# EAGLE design Counter (EAGLE 8.6.1)
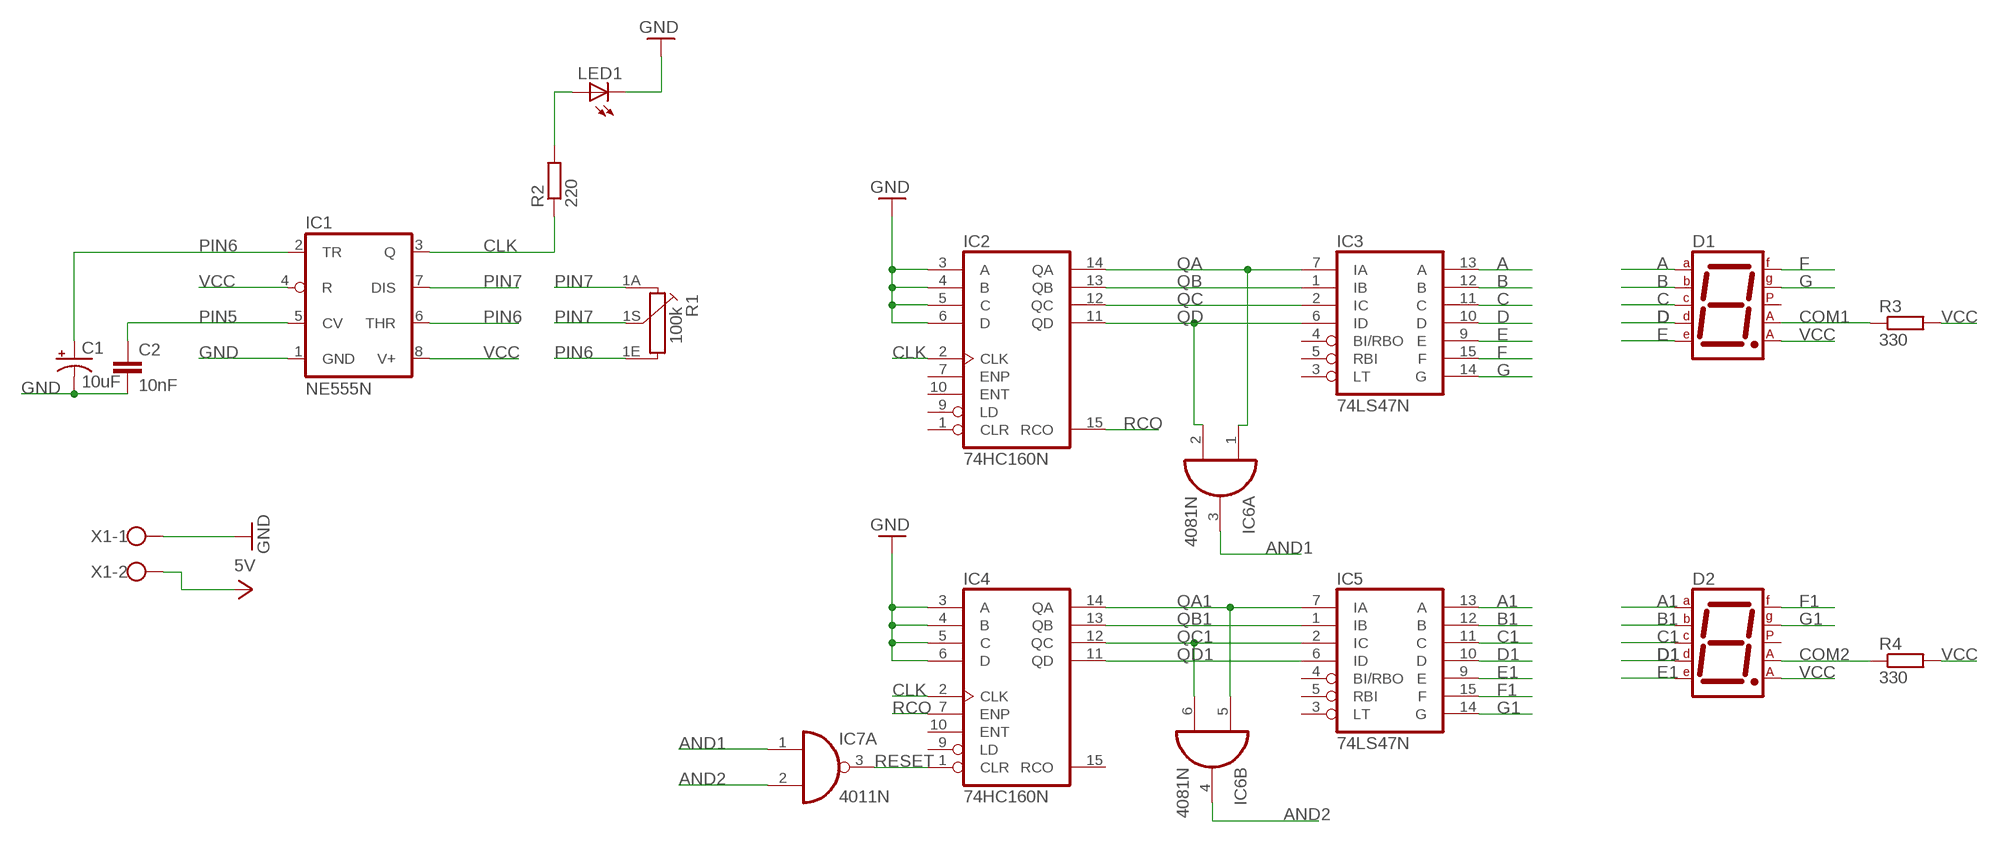
[diagram p0: schematic, sheet 1]

## Parts
C1  10uF  CPOL-USE2.5-7  [E2,5-7]
C2  10nF  C-EU050-025X075  [C050-025X075]
D1  7SEG-CA  [7SEG-13]
D2  7SEG-CA  [7SEG-13]
IC1  NE555N  [DIL08-ROUND]
IC2  74HC160N  [DIL16]
IC3  74LS47N  [DIL16]
IC4  74HC160N  [DIL16]
IC5  74LS47N  [DIL16]
IC6  4081N  [DIL14]
IC7  4011N  [DIL14]
LED1  LED5MM  [LED5MM]
R1  100k  PC16S  [PC16S]
R2  220  R-EU_0207/10  [0207/10]
R3  330  R-EU_0207/10  [0207/10]
R4  330  R-EU_0207/10  [0207/10]
X1  W237-102  [W237-102]

## Nets
A: D1.7(A) IC3.13(A)
A1: D2.7(A) IC5.13(A)
AND1: IC6.3(A:O) IC7.1(A:I0)
AND2: IC6.4(B:O) IC7.2(A:I1)
B: D1.6(B) IC3.12(B)
B1: D2.6(B) IC5.12(B)
C: D1.4(C) IC3.11(C)
C1: D2.4(C) IC5.11(C)
CLK: IC1.3(Q) IC2.2(CLK) IC4.2(CLK) R2.1
COM1: D1.3(CA1) R3.1
COM2: D2.3(CA1) R4.1
D: D1.2(D) IC3.10(D)
D1: D2.2(D) IC5.10(D)
E: D1.1(E) IC3.9(E)
E1: D2.1(E) IC5.9(E)
F: D1.9(F) IC3.15(F)
F1: D2.9(F) IC5.15(F)
G: D1.10(G) IC3.14(G)
G1: D2.10(G) IC5.14(G)
GND: C1.- C2.2 IC1.1(GND) IC2.3(A) IC2.4(B) IC2.5(C) IC2.6(D) IC4.3(A) IC4.4(B) IC4.5(C) IC4.6(D) LED1.K(C) X1.1
LED: LED1.A R2.2
PIN5: C2.1 IC1.5(CV)
PIN6: C1.+ IC1.2(TR) IC1.6(THR) R1.1E
PIN7: IC1.7(DIS) R1.1A R1.1S
QA: IC2.14(QA) IC3.7(IA) IC6.1(A:I0)
QA1: IC4.14(QA) IC5.7(IA) IC6.5(B:I0)
QB: IC2.13(QB) IC3.1(IB)
QB1: IC4.13(QB) IC5.1(IB)
QC: IC2.12(QC) IC3.2(IC)
QC1: IC4.12(QC) IC5.2(IC) IC6.6(B:I1)
QD: IC2.11(QD) IC3.6(ID) IC6.2(A:I1)
QD1: IC4.11(QD) IC5.6(ID)
RCO: IC2.15(RCO) IC4.7(ENP)
RESET: IC4.1(CLR) IC7.3(A:O)
VCC: D1.8(CA2) D2.8(CA2) IC1.4(R) IC1.8(V+) R3.2 R4.2 X1.2 ; supply symbol labelled 5V
Unconnected: D1.5(DP) D2.5(DP) IC2.1(CLR) IC2.7(ENP) IC2.9(LD) IC2.10(ENT) IC3.3(LT) IC3.4(BI/RBO) IC3.5(RBI) IC4.9(LD) IC4.10(ENT) IC4.15(RCO) IC5.3(LT) IC5.4(BI/RBO) IC5.5(RBI) IC6.8(C:I0) IC6.9(C:I1) IC6.10(C:O) IC6.11(D:O) IC6.12(D:I0) IC6.13(D:I1) IC7.4(B:O) IC7.5(B:I0) IC7.6(B:I1) IC7.8(C:I0) IC7.9(C:I1) IC7.10(C:O) IC7.11(D:O) IC7.12(D:I0) IC7.13(D:I1)

## Power pins joined to a net without a drawn wire
GND: IC2.8(GND) IC3.8(GND) IC4.8(GND) IC5.8(GND) IC6.7(P:VSS) IC7.7(P:VSS)
VCC: IC2.16(VCC) IC3.16(VCC) IC4.16(VCC) IC5.16(VCC) IC6.14(P:VDD) IC7.14(P:VDD)

## Library data of the parts
C1 = resistor:CPOL-US: POLARIZED CAPACITOR, American symbol
C2 = rcl:C-EU: CAPACITOR, European symbol; SPICEPREFIX: C
D1 D2 = special:7SEG-CA: 7-segment DISPLAY single anode, 13 mm
IC1 = adafruit:*555: TIMER Changed DIP package to have round (not oval) pin pads http://www.ladyada.net/library/pcb/eaglelibrary.html
IC2 IC4 = 74xx-eu:74*160: Synchronous 4-bit COUNTER
IC3 IC5 = 74xx-eu:74*47: BCD to seven segment DECODER/DRIVER Source: http://www.ee.washington.edu/stores/DataSheets/74ls/74ls47.pdf
IC6 = 40xx:4081: Quad 2-input AND
IC7 = 40xx:4011: Quad 2-input NAND
LED1 = adafruit:LED: LED OSRAM: - CHIPLED LG R971, LG N971, LY N971, LG Q971, LY Q971, LO R971, LY R971 LH N974, LH R974 LS Q976, LO Q976, LY Q976 LO Q996 - Hyper CHIPLED LW Q18S LB Q993, LB Q99A, LB R99A - SideLED LS A670, LO A670, LY A670, LG A670, LP A670 LB A673, LV A673, LT A673, LW A673 LH A674 LY A675 LS A676, LA A676, LO A676, LY A676, LW A676 LS A679, LY A679, LG A679 - Hyper Micro SIDELED® LS Y876, LA Y876, LO Y876, LY Y876 LT Y87S - SmartLED LW L88C, LW L88S LB L89C, LB L89S, LG L890 LS L89K, LO L89K, LY L89K LS L896, LA L896, LO L896, LY L896 - TOPLED LS T670, LO T670, LY T670, LG T670, LP T670 LSG T670, LSP T670, LSY T670, LOP T670, LYG T670 LG T671, LOG T671, LSG T671 LB T673, LV T673, LT T673, LW T673 LH T674 LS T676, LA T676, LO T676, LY T676, LB T676, LH T676, LSB T676, LW T676 LB T67C, LV T67C, LT T67C, LS T67K, LO T67K, LY T67K, LW E67C LS E67B, LA E67B, LO E67B, LY E67B, LB E67C, LV E67C, LT E67C LW T67C LS T679, LY T679, LG T679 LS T770, LO T770, LY T770, LG T770, LP T770 LB T773, LV T773, LT T773, LW T773 LH T774 LS E675, LA E675, LY E675, LS T675 LS T776, LA T776, LO T776, LY T776, LB T776 LHGB T686 LT T68C, LB T68C - Hyper Mini TOPLED® LB M676 - Mini TOPLED Santana® LG M470 LS M47K, LO M47K, LY M47K Source: http://www.osram.convergy.de/
R1 = piher:PC16S: POTENTIOMETER single carbon potentiometer, 16 mm, S3ROH; OC_FARNELL: 4452940; OC_NEWARK: unknown
R2-R4 = rcl:R-EU_: RESISTOR, European symbol; SPICEPREFIX: R
X1 = con-wago-500:W237-102: WAGO SCREW CLAMP; MPN: 237-102; OC_FARNELL: unknown; OC_NEWARK: 70K9898

## Net classes
0 default: width 0.7 mm, drill 0.8 mm, clearance 0.9 mm

## Board
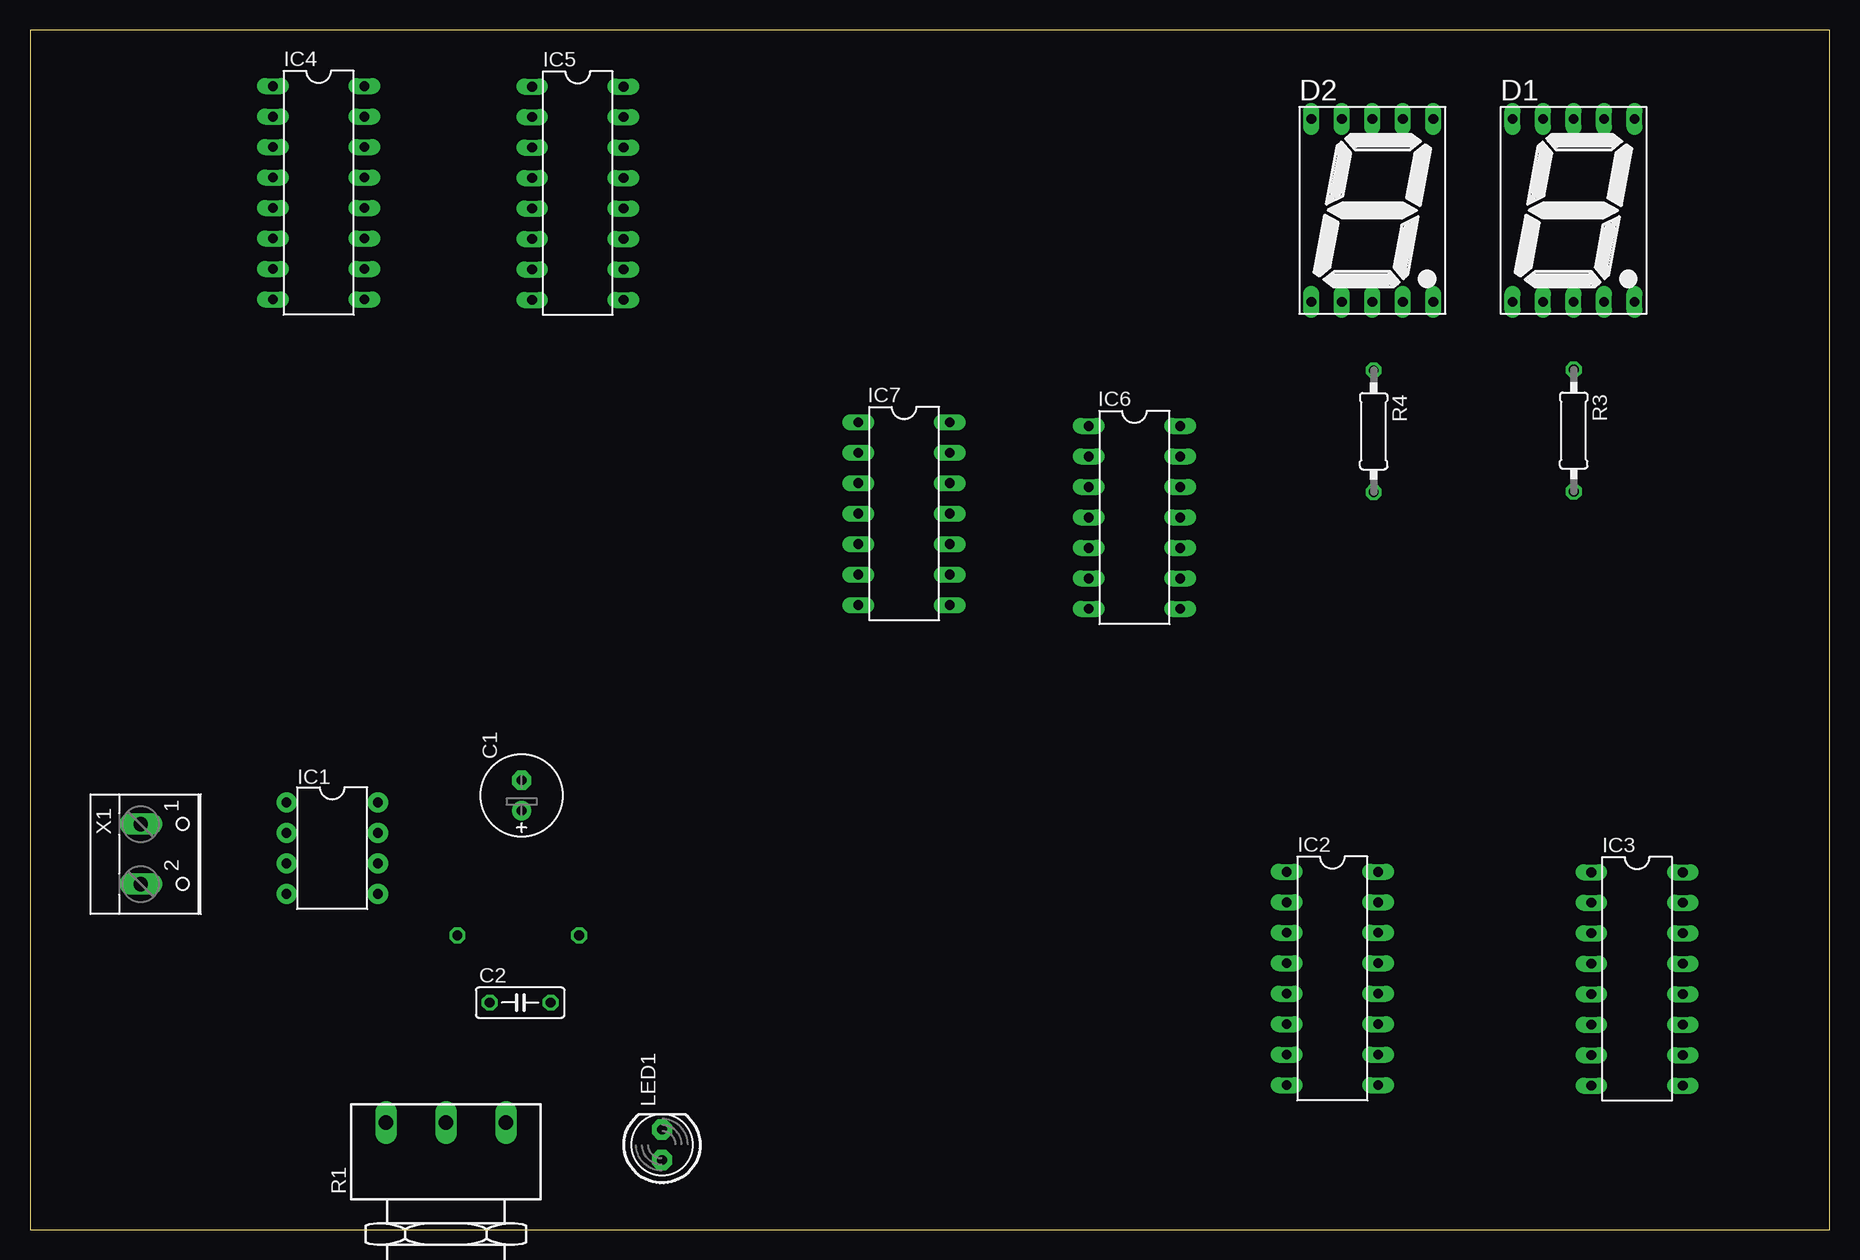
[diagram p1: board, top side]
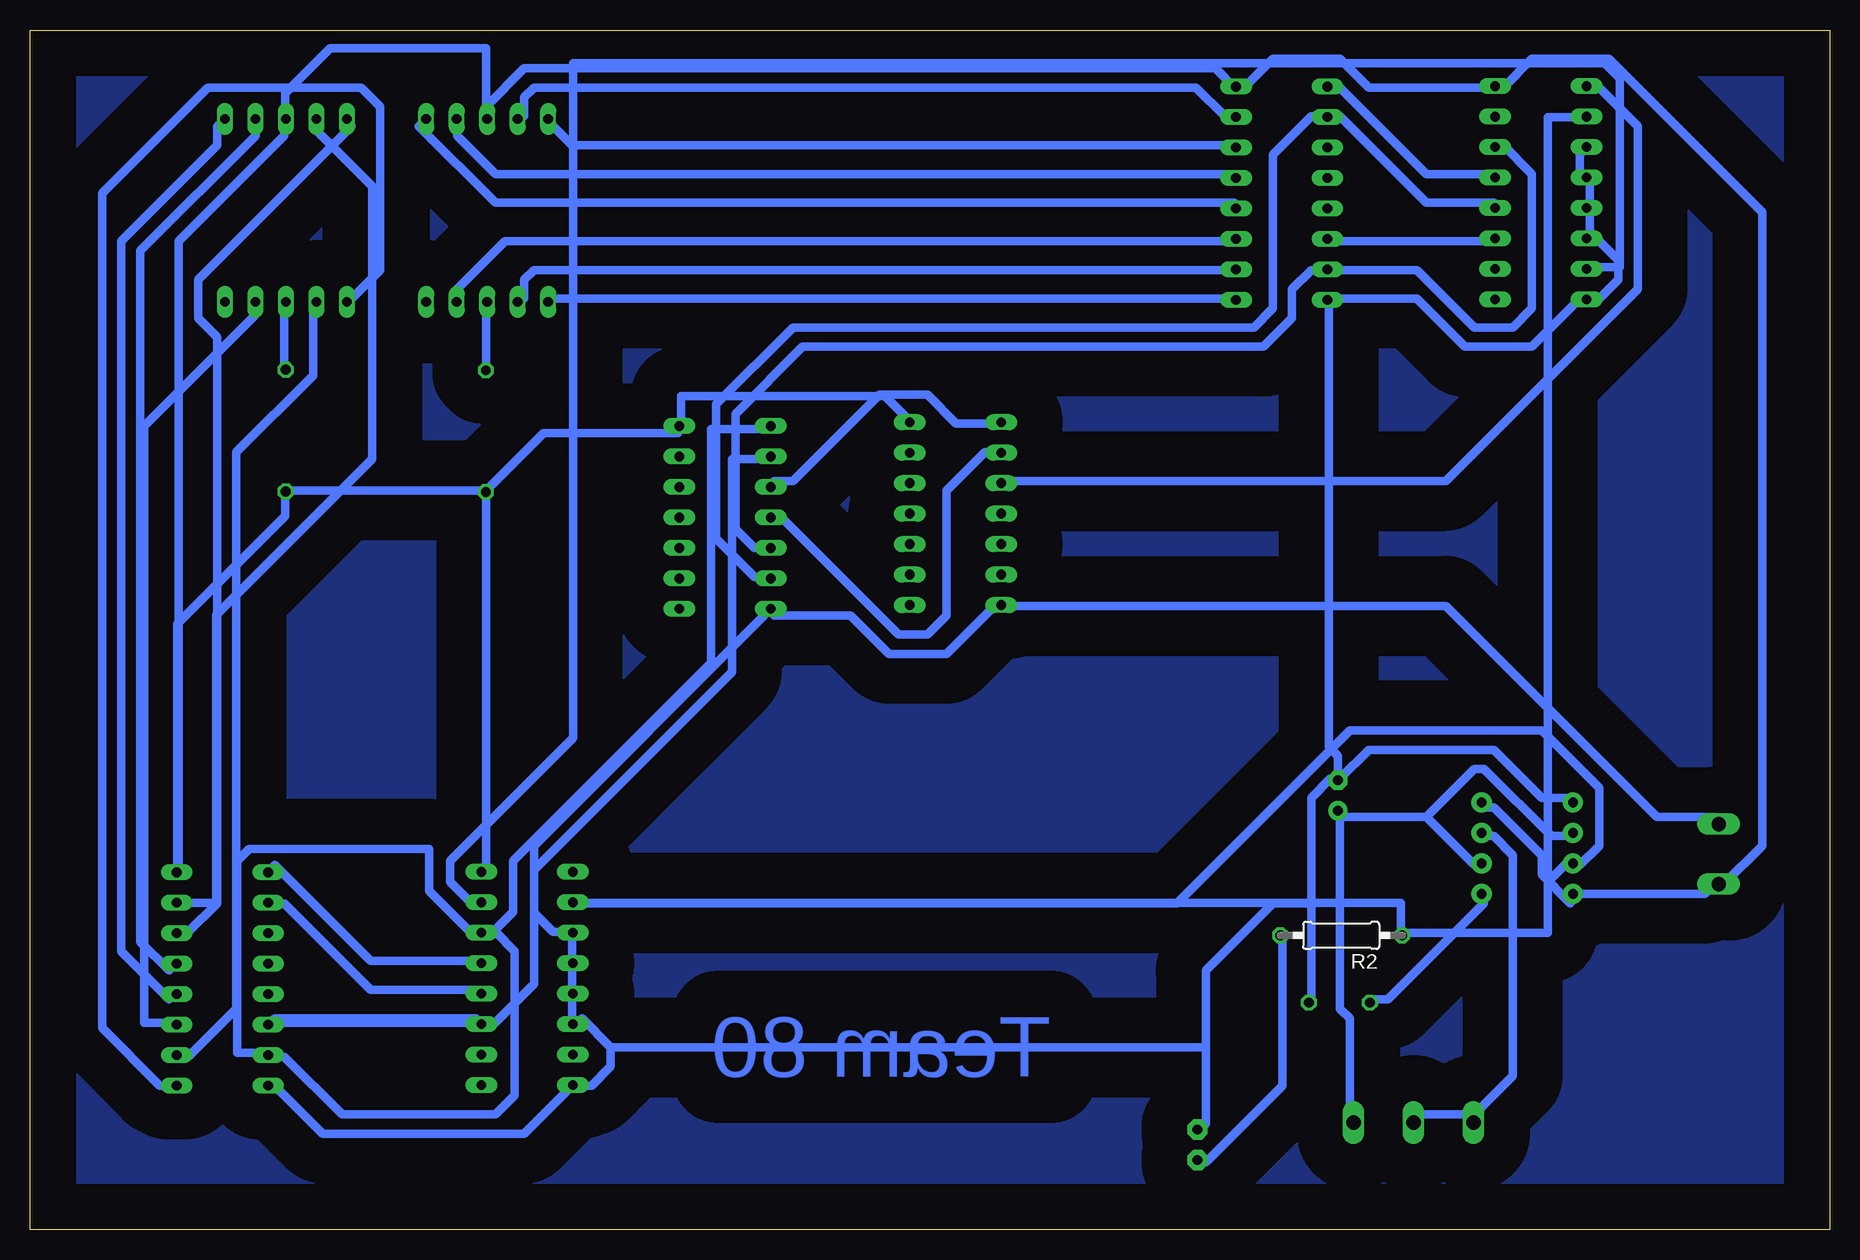
[diagram p2: board, bottom side, seen from below]

Size 150 x 100 mm. Coordinates in mm from the lower left corner, seen from the top.
Outline: 0,0 150,0 150,100 0,100 0,0
Copper layers (1*16): layer 1 0.035mm / dielectric 1.5mm / Bottom 0.035mm
Design rules "default": minimum track width 6mil, minimum drill 0.35mm, track to track 6mil, track to pad 6mil, pad to pad 6mil, via to via 6mil, smd to smd 6mil, copper to edge 40mil, drill to drill 6mil, minimum pad ring 10mil, minimum via ring 8mil, stop-mask expansion 4mil, vias tented up to drill 0mil, thermal gap 10mil

### Footprints (pad centres in the part's own frame; a part is rotated, then mirrored left to right if it is on the bottom)
E2,5-7 = drill 0.813 pad 1.6: + -1.27,0 | drill 0.813 pad 1.6 octagon: - 1.27,0
C050-025X075 = drill 0.813 octagon: 1 -2.54,0; 2 2.54,0
7SEG-13 = drill 0.813 long: 1 -5.08,-7.62; 2 -2.54,-7.62; 3 0,-7.62; 4 2.54,-7.62; 5 5.08,-7.62; 6 5.08,7.62; 7 2.54,7.62; 8 0,7.62; 9 -2.54,7.62; 10 -5.08,7.62
DIL08-ROUND = drill 0.813 pad 1.676: 1 -3.81,-3.81; 2 -1.27,-3.81; 3 1.27,-3.81; 4 3.81,-3.81; 5 3.81,3.81; 6 1.27,3.81; 7 -1.27,3.81; 8 -3.81,3.81
DIL16 = drill 0.813 long: 1 -8.89,-3.81; 2 -6.35,-3.81; 3 -3.81,-3.81; 4 -1.27,-3.81; 5 1.27,-3.81; 6 3.81,-3.81; 7 6.35,-3.81; 8 8.89,-3.81; 9 8.89,3.81; 10 6.35,3.81; 11 3.81,3.81; 12 1.27,3.81; 13 -1.27,3.81; 14 -3.81,3.81; 15 -6.35,3.81; 16 -8.89,3.81
DIL14 = drill 0.813 long: 1 -7.62,-3.81; 2 -5.08,-3.81; 3 -2.54,-3.81; 4 0,-3.81; 5 2.54,-3.81; 6 5.08,-3.81; 7 7.62,-3.81; 8 7.62,3.81; 9 5.08,3.81; 10 2.54,3.81; 11 0,3.81; 12 -2.54,3.81; 13 -5.08,3.81; 14 -7.62,3.81
LED5MM = drill 0.813 pad 1.676 octagon: A -1.27,0; K 1.27,0
PC16S = drill 1.2 long: 1A -5,6.5; 1E 5,6.5; 1S 0,6.5
0207/10 = drill 0.813 octagon: 1 -5.08,0; 2 5.08,0
W237-102 = drill 1.194 long: 1 -2.5,-1.27; 2 2.5,-1.27

### Placement (x,y rotation side)
C1  40.98,36.18 90 top
C2  40.86,18.92 0 top
D1  128.66,84.96 0 top
D2  111.89,84.96 0 top
IC1  25.19,31.79 270 top
IC2  108.56,20.93 270 top
IC3  133.96,20.89 270 top
IC4  24.06,86.43 270 top
IC5  45.66,86.39 270 top
IC6  92.06,59.36 270 top
IC7  72.86,59.68 270 top
LED1  52.68,7.06 90 top
R1  34.67,2.42 0 top
R2  40.7,24.52 180 bottom
R3  128.68,66.6 270 top
R4  112,66.55 270 top
X1  10.5,31.3 270 top

### Tracks (layer width: path | path; a pad name or v marks a point on that pad's centre or on a via)
A
  Bottom 0.7: D1.7 131.2,91.2 140.8,81.6 140.8,24 138.4,21.6 IC3.13
A1
  Bottom 0.7: IC5.13 49.6,88 111.2,88 114.4,91.2 114.4,92 D2.7
AND1
  Bottom 0.7: IC7.1 69.6,67.2 72.8,67.2 75.2,69.6 79.2,69.6 86.4,62.4 88,62.4 IC6.3
AND2
  Bottom 0.7: IC7.2 69.6,64.8 70.4,64.8 73.6,61.6 73.6,51.2 75.2,49.6 77.6,49.6 87.2,59.2 88,59.2 IC6.4
B
  Bottom 0.7: D1.6 134.4,92 134.4,90.4 142.4,82.4 142.4,23.2 138.4,19.2 IC3.12
B1
  Bottom 0.7: IC5.12 49.6,85.6 111.2,85.6 117.6,92 D2.6
C
  Bottom 0.7: IC3.11 138,17.25 140.5,17.25 140.5,67 131.25,76.25 131.25,77.25 D1.4
C1
  Bottom 0.7: D2.4 114.4,77.6 114.4,78.4 110.4,82.4 49.6,82.4 IC5.11
CLK
  Bottom 0.7: 23.5,29 23.5,24.75 35.5,24.75 R2.1 35.75,25 35.75,27.25 104.75,27.25 IC2.2 104,27.2 54.4,27.2 40,41.6 24,41.6 19.2,36.8 19.2,32 20.8,30.4 IC1.3 21.5,30.5 22,30.5 23.5,29 | 23.5,29 23.5,92.75 20.25,92.75 IC4.2
COM1
  Bottom 0.7: D1.3 128.8,76.8 128.8,72 R3.1
COM2
  Bottom 0.7: R4.1 112,76.8 D2.3
D
  Bottom 0.7: IC3.10 137.6,14.4 136.8,14.4 132.8,18.4 132.8,64.8 126.4,71.2 126.4,76.8 D1.2
D1
  Bottom 0.7: D2.2 108.8,77.6 108.8,79.2 108,80 49.6,80 IC5.10
E
  Bottom 0.7: IC3.9 139.2,12 144,16.8 144,86.4 135.2,95.2 122.4,95.2 120.8,93.6 120.8,80 123.2,77.6 D1.1
E1
  Bottom 0.7: D2.1 106.4,77.6 49.6,77.6 IC5.9
F
  Bottom 0.7: IC3.15 137.75,27.25 134.5,27.25 134.5,51.25 121.5,64.25 121.5,87 126,91.5 126,92.5 D1.9
F1
  Bottom 0.7: D2.9 108.8,92.8 108.8,94.4 108,95.2 52.8,95.2 50.4,92.8 49.6,92.8 IC5.15
G
  Bottom 0.7: IC3.14 137.6,24.8 136.8,24.8 134.4,27.2 134.4,74.4 136,76 136,79.2 123.2,92 D1.10
G1
  Bottom 0.7: IC5.14 49.6,90.4 104.8,90.4 106.4,92 D2.10
GND
  Bottom 0.7: 43.2,27.2 43.2,36 41.6,37.6 C1.- | 43.2,27.2 43.2,19.2 C2.2 | 52,15.2 52,21.6 46.4,27.2 43.2,27.2 | 52,15.2 52,8.8 LED1.K | IC1.1 21.6,36 24,36 28,40 38.4,40 40.8,37.6 C1.- | 104.8,24.8 104.8,22.4 IC2.4 104.8,21.6 104.8,20 IC2.5 104.8,19.2 104.8,17.6 IC2.6 104,17.6 101.6,15.2 | 101.6,15.2 101.6,13.6 103.2,12 104,12 IC2.8 104.8,12 108.8,8 125.6,8 129.6,12 IC3.8 | X1.1 9.6,34.4 14.4,34.4 32,52 68.8,52 IC7.7 69.6,52 73.6,48 78.4,48 81.6,51.2 88,51.2 IC6.7 88.8,51.2 108,32 108,26.4 106.4,24.8 104.8,24.8 | 104.8,24.8 IC2.3 | 101.6,15.2 52,15.2 | IC4.3 20.8,89.6 20.8,88 IC4.4 20,87.2 20,85.6 IC4.5 20,84.8 20,83.2 | 20,83.2 17.6,80.8 17.6,79.2 19.2,77.6 20,77.6 IC4.8 20.8,77.6 24.8,73.6 30.4,73.6 34.4,77.6 41.6,77.6 IC5.8 41.75,77.5 41.75,40.25 41,39.5 41,37.5 C1.- | 20,83.2 IC4.6
LED
  Bottom 0.7: R2.2 45.6,24 45.6,12 52,5.6 LED1.A
PIN5
  Bottom 0.7: C2.1 38.4,19.2 36.8,19.2 28.8,27.2 IC1.5
PIN6
  Bottom 0.7: 33.6,34.4 40.8,34.4 | 33.6,34.4 29.6,30.4 IC1.6 | 33.6,34.4 29.6,38.4 28.8,38.4 23.2,32.8 21.6,32.8 IC1.2 | 40.8,34.4 40.8,18.4 40,17.6 40,9.6 R1.1E | 40.8,34.4 C1.+
PIN7
  Bottom 0.7: IC1.7 28.8,32.8 28,32.8 26.4,31.2 26.4,12.8 29.6,9.6 R1.1A 30.4,9.6 34.4,9.6 R1.1S
QA
  Bottom 0.7: IC2.14 112,24.8 111.2,24.8 109.6,23.2 109.6,11.2 111.2,9.6 124,9.6 128.8,14.4 129.6,14.4 IC3.7 130.25,14.75 132.75,14.75 132.75,30.75 131.75,31.75 116.75,31.75 116.75,28.25 113.25,24.75 112.5,24.75 IC2.14 | IC6.1 88.25,66.75 93.25,66.75 93.25,47.25 109.75,30.75 109.75,26.5 111.25,25 112.25,25 IC2.14
QA1
  Bottom 0.7: IC4.14 27.2,90.4 24.8,88 24.8,76.8 26.4,75.2 29.6,75.2 34.4,80 41.6,80 IC5.7 42.4,80 43.2,80 44.8,78.4 44.8,76 47.2,73.6 85.6,73.6 91.2,68 91.2,58.4 89.6,56.8 88.8,56.8 IC6.5
QB
  Bottom 0.7: IC2.13 112.8,22.4 121.6,22.4 129.6,30.4 IC3.1
QB1
  Bottom 0.7: IC4.13 28,88 33.6,88 40.8,95.2 41.6,95.2 IC5.1
QC
  Bottom 0.7: IC2.12 112.8,20 121.6,20 128.8,27.2 129.6,27.2 IC3.2
QC1
  Bottom 0.7: IC4.12 28,85.6 33.6,85.6 40.8,92.8 41.6,92.8 IC5.2 42.4,92.8 43.2,92.8 46.4,89.6 46.4,76.8 48,75.2 86.4,75.2 92.8,68.8 92.8,57.6 89.6,54.4 88.8,54.4 IC6.6
QD
  Bottom 0.7: IC2.11 112.8,17.6 129.6,17.6 IC3.6 130,17.25 112.5,17.25 IC2.11 | IC6.2 88.25,64.25 91.5,64.25 91.5,46.5 108,30 108,20.5 111.25,17.25 112.25,17.25 IC2.11
QD1
  Bottom 0.7: IC5.6 41.6,82.4 28,82.4 IC4.11
RCO
  Bottom 0.7: IC4.7 20.25,80.25 17.5,80.25 17.5,96 18.75,97.25 104.75,97.25 104.75,41 115,30.75 115,29 113.5,27.5 112.5,27.5 IC2.15
RESET
  Bottom 0.7: IC4.1 20,95.2 19.2,95.2 16,92 16,78.4 32,62.4 68.8,62.4 IC7.3
S$1
  pour Bottom (isolate 3.81): 0.7,0.9 0.7,98.1 147.4,98.1 147.4,0.8 0.7,0.8
VCC
  Bottom 0.7: 112,61.6 107.2,66.4 96,66.4 IC6.14 95.75,67 95.75,69.5 78.75,69.5 76.75,67.5 IC7.14 | IC2.16 112,30.4 R4.2 112,61.6 | 112,61.6 128.8,61.6 R3.2 128.75,61.5 128.75,59.5 137.75,50.5 137.75,30 IC3.16 137.6,30.4 137.6,82.4 128.8,91.2 128.8,92 D1.8 128.75,92.75 128.75,94.75 125,98.5 112,98.5 112,92.75 D2.8 112,92.8 112,93.6 108.8,96.8 51.2,96.8 49.6,95.2 IC5.16 48.8,95.2 46.4,97.6 40.8,97.6 38.4,95.2 28,95.2 IC4.16 27.2,95.2 24.8,97.6 18.4,97.6 5.6,84.8 5.6,32 8.8,28.8 X1.2 9.6,28.8 10.4,28 20.8,28 IC1.4 21.6,27.2 24,29.6 24,31.2 28,35.2 28.8,35.2 IC1.8

### Text on the board
Bottom: Team 80